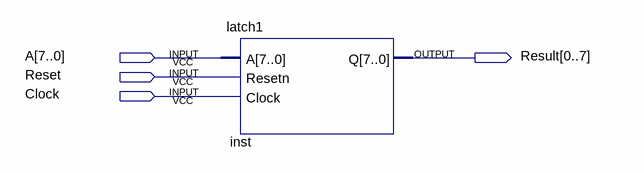
[diagram p0: schematic sheet]
// Quartus schematic latch1BDF.bdf as structural Verilog: 1 symbols, 4 pins
module latch1BDF (
  input  [7:0] A,
  input  Reset,
  input  Clock,
  output [0:7] Result
);

  latch1 inst (.A(A), .Resetn(Reset), .Clock(Clock), .Q(Result));
endmodule
